# Altium schematic sheet pwr_supply.SchDoc
size A4; SheetNumber: 2; SheetTotal: 7
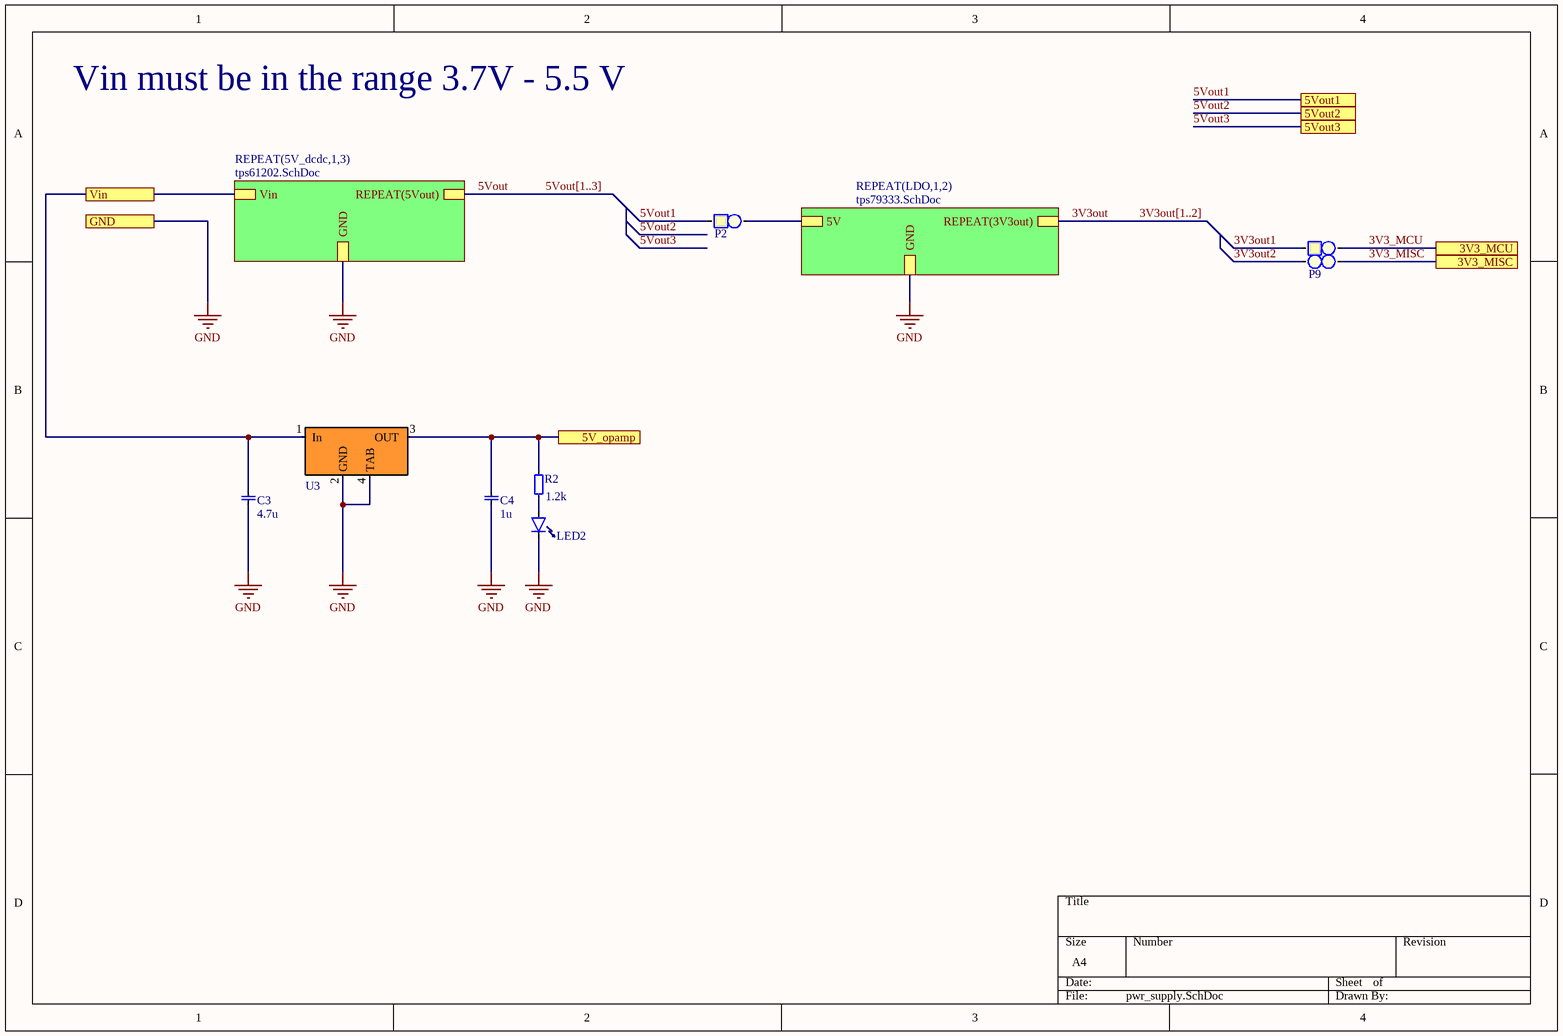
[diagram p0: pwr_supply.SchDoc]

## Parts
C3  value 4.7u  [1206, capasitor]  (hidden comment: 1206, capacitor)
C4  value 1u  [1206, capasitor]  (hidden comment: 1206, capacitor)
LED2  0805, LED  [0805_led]  (value not drawn)
P2  Jumper  [padtwo_L]  (value not drawn)
P9  2x2 Pin Header  [2x2 PH]  (value not drawn)
R2  value 1.2k  [1206]  (hidden comment: 1206, resistor)
U3  MCP1826S  [SOT223]  (value not drawn)

## Sub-sheets
REPEAT(5V_dcdc,1,3) = tps61202.SchDoc: Vin, REPEAT(5Vout), GND
REPEAT(LDO,1,2) = tps79333.SchDoc: REPEAT(3V3out), GND, 5V

## Ports
3V3_MCU, 3V3_MISC, 5V_opamp, 5Vout1, 5Vout2, 5Vout3, GND, Vin

## Nets
GND: C3.0 C4.0 LED2.0(Cathode) U3.2(GND) U3.4(TAB) ; port GND, sheet REPEAT(LDO,1,2)/GND, sheet REPEAT(5V_dcdc,1,3)/GND
3V3_MCU: P9.4 ; port 3V3_MCU
3V3_MISC: P9.3 ; port 3V3_MISC
3V3out: sheet REPEAT(LDO,1,2)/REPEAT(3V3out)
3V3out1: P9.1
3V3out2: P9.2
5V_opamp: C4.1 R2.0 U3.3(OUT) ; port 5V_opamp
5Vout: sheet REPEAT(5V_dcdc,1,3)/REPEAT(5Vout)
5Vout1: P2.1 ; port 5Vout1
5Vout2: port 5Vout2
5Vout3: port 5Vout3
Vin: C3.1 U3.1(In) ; port Vin, sheet REPEAT(5V_dcdc,1,3)/Vin
NetLED2_1: LED2.1 R2.1
NetP2_2: P2.2 ; sheet REPEAT(LDO,1,2)/5V

## Buses and harness runs
bus 3V3out[1..2]
bus 5Vout[1..3]

## Notes on the sheet
- Vin must be in the range 3.7V - 5.5 V

## Library data of the parts
LED2 = 0805, LED: Value: 0805 LED
P2 = Jumper: 2.54 mm, TH; Value: 1x2 Pin Header
P9 = 2x2 Pin Header: Value: 2x2 Pin Header, 2.54mm
R2 = 1206, resistor: Resistor; DigiKey: RMCF1206JT1K20TR-ND
U3 = MCP1826S: Max input voltage is 6.0 V, tab connects to ground; DigiKey: MCP1826S-5002E/DB-ND
C3 C4 = 1206, capacitor
  C4: DigiKey: 478-12816-1-ND